# Altium project A7000RiscPC_Joystick.PrjPcb
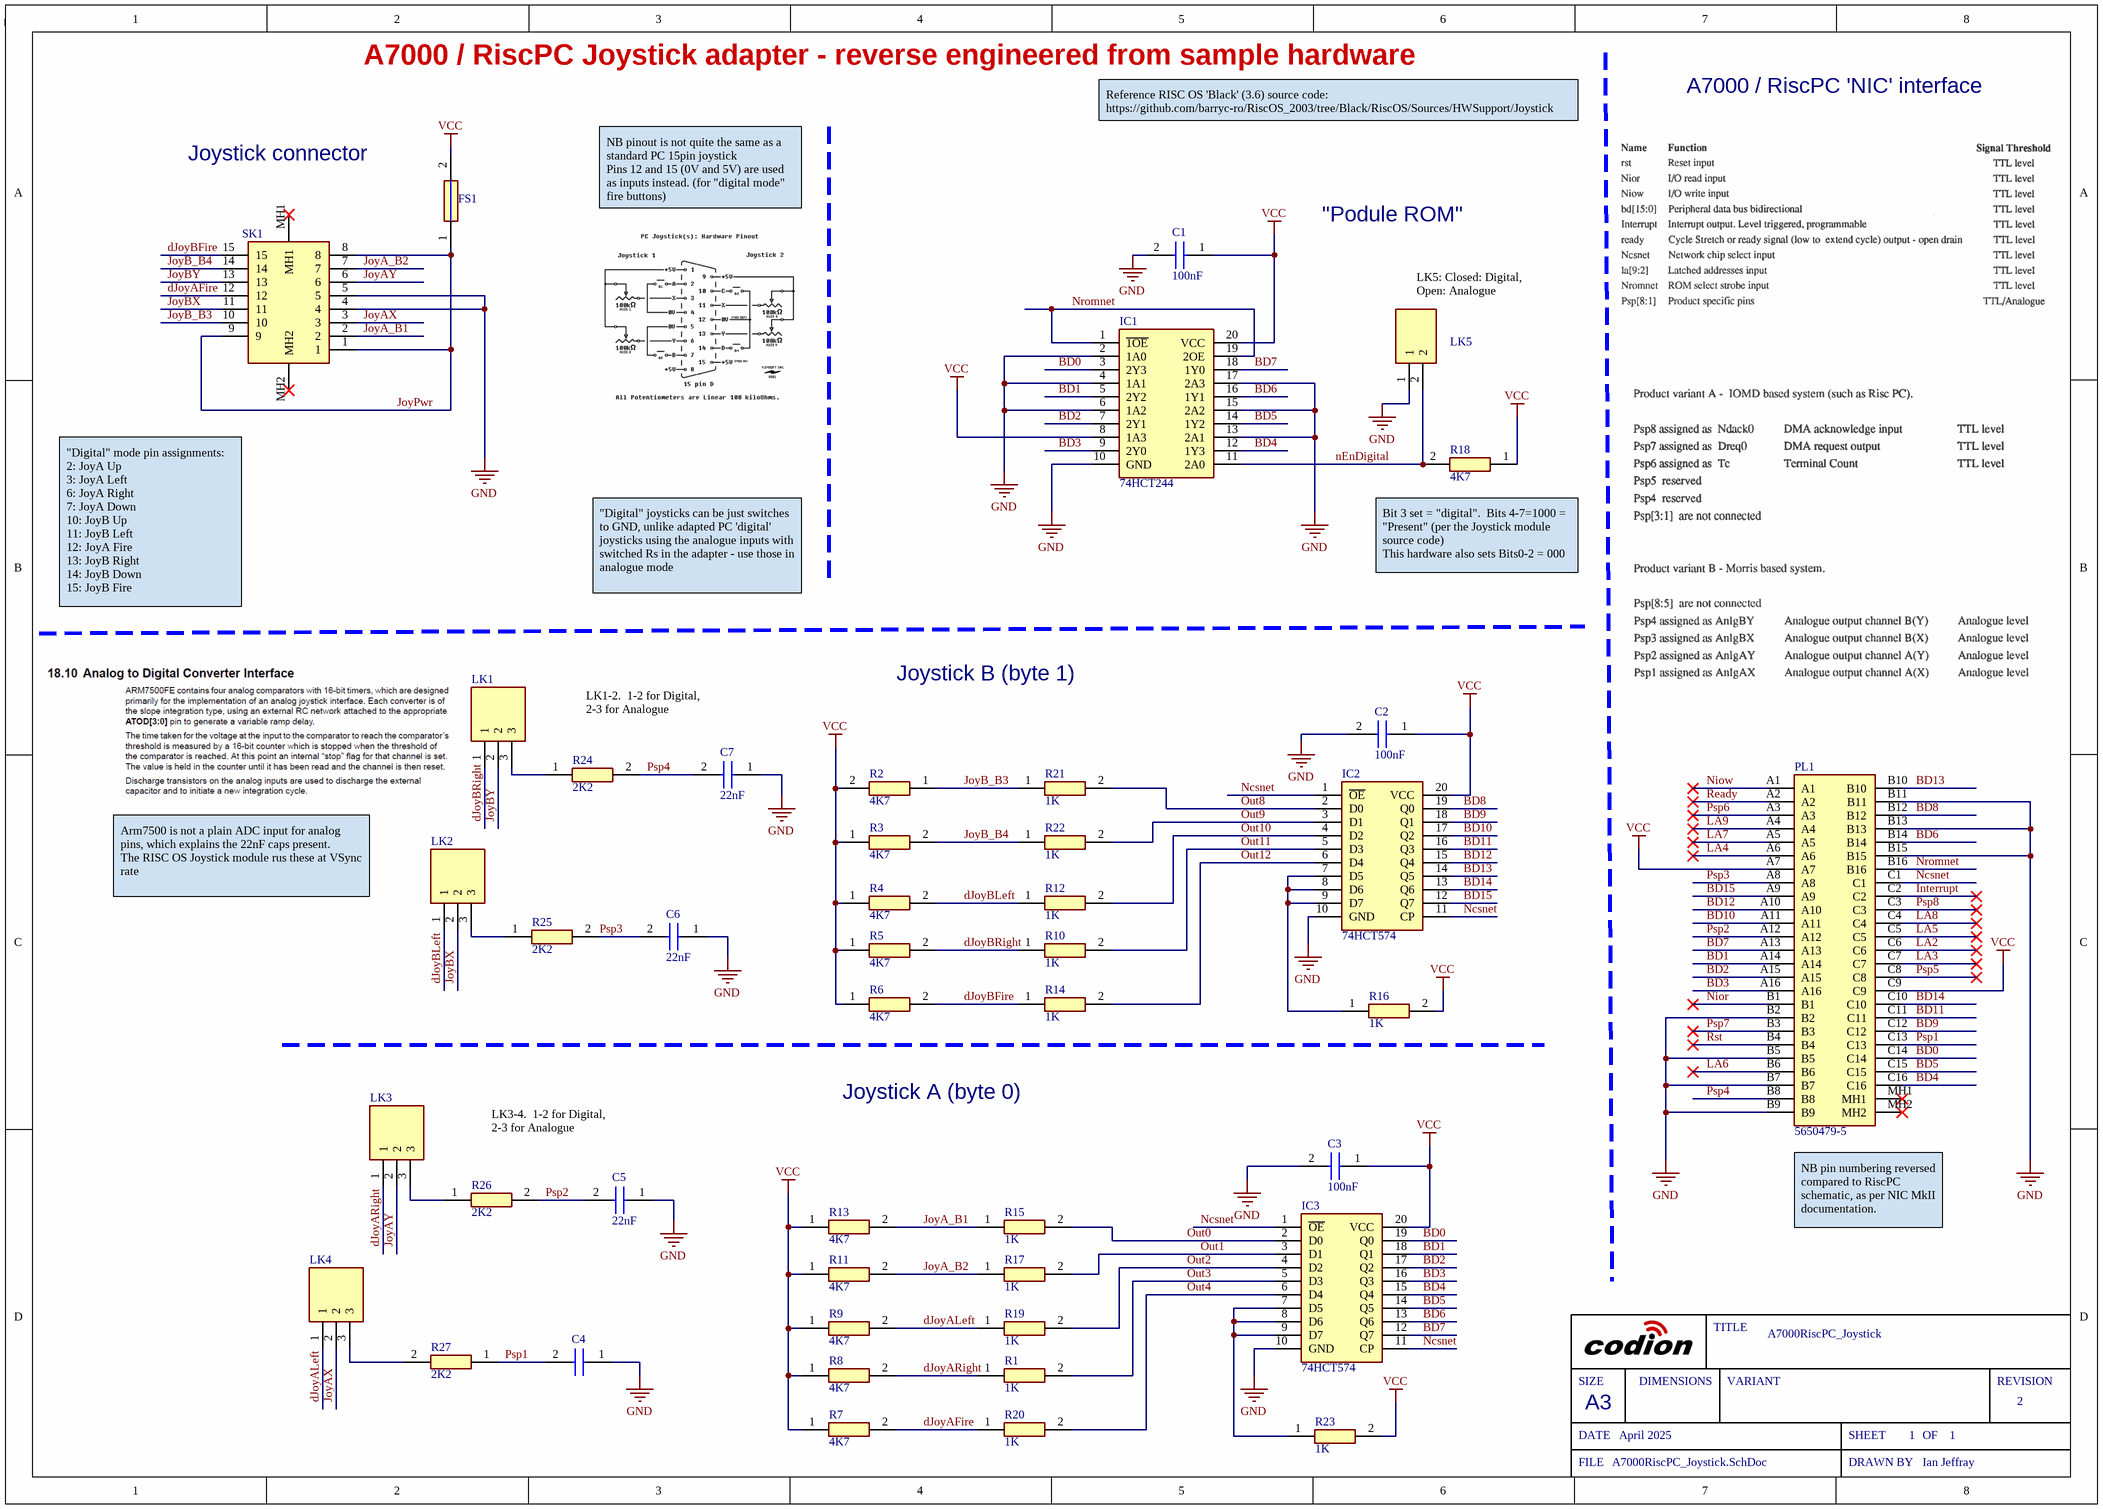
[diagram p0: A7000RiscPC_Joystick.SchDoc]
Sch_RevNo: 2; Sch_ReleaseDate: April 2025; Project_Title: A7000RiscPC_Joystick; DrawnBy: Ian Jeffray
1 sheet, 45 parts. Net scope: global (net labels, ports and power ports of the same name join across sheets).
Board file: A7000RiscPC_Joystick.PcbDoc

## Sheet A7000RiscPC_Joystick.SchDoc
size A3; SheetNumber: 1; SheetTotal: 1

### Parts
C1  100nF  [CAPC1608X90N]
C2  100nF  [CAPC1608X90N]
C3  100nF  [CAPC1608X90N]
C4  06033C104KAT4A  [CAPC1608X90N]  (value not drawn)
C5  22nF  [CAPC1608X90N]
C6  22nF  [CAPC1608X90N]
C7  22nF  [CAPC1608X90N]
FS1  0679L0250-05  [FUSC6125X279N]  (value not drawn)
IC1  74HCT244  [SOIC127P1030X265-20N]
IC2  74HCT574  [SOIC127P1030X265-20N]
IC3  74HCT574  [SOIC127P1030X265-20N]
LK1  PREC003SAAN-RC  [HDRV3W64P0X254_1X3_762X254X868P]  (value not drawn)
LK2  PREC003SAAN-RC  [HDRV3W64P0X254_1X3_762X254X868P]  (value not drawn)
LK3  PREC003SAAN-RC  [HDRV3W64P0X254_1X3_762X254X868P]  (value not drawn)
LK4  PREC003SAAN-RC  [HDRV3W64P0X254_1X3_762X254X868P]  (value not drawn)
LK5  PREC002SAAN-RC  [HDRV2W64P0X254_1X2_508X254X854P]  (value not drawn)
PL1  5650479-5  [56504795]
R1  1K  [RESC1005X35N]
R2  4K7  [RESC1005X35N]
R3  4K7  [RESC1005X35N]
R4  4K7  [RESC1005X35N]
R5  4K7  [RESC1005X35N]
R6  4K7  [RESC1005X35N]
R7  4K7  [RESC1005X35N]
R8  4K7  [RESC1005X35N]
R9  4K7  [RESC1005X35N]
R10  1K  [RESC1005X35N]
R11  4K7  [RESC1005X35N]
R12  1K  [RESC1005X35N]
R13  4K7  [RESC1005X35N]
R14  1K  [RESC1005X35N]
R15  1K  [RESC1005X35N]
R16  1K  [RESC1005X35N]
R17  1K  [RESC1005X35N]
R18  4K7  [RESC1005X35N]
R19  1K  [RESC1005X35N]
R20  1K  [RESC1005X35N]
R21  1K  [RESC1005X35N]
R22  1K  [RESC1005X35N]
R23  1K  [RESC1005X35N]
R24  2K2  [RESC1005X35N]
R25  2K2  [RESC1005X35N]
R26  2K2  [RESC1005X35N]
R27  2K2  [RESC1005X35N]
SK1  5747845-4  [57478454]  (value not drawn)

### Nets
GND: C1.2 C2.2 C3.2 C4.1 C5.1 C6.1 C7.1 IC1.2(1A0) IC1.4(1A1) IC1.6(1A2) IC1.10(GND) IC1.13(2A1) IC1.15(2A2) IC1.17(2A3) IC2.10(GND) IC3.10(GND) LK5.1 PL1.B2 PL1.B5 PL1.B7 PL1.B9 PL1.B11 PL1.B13 PL1.B15 SK1.4 SK1.5
VCC: C1.1 C2.1 C3.1 FS1.2 IC1.8(1A3) IC1.20(VCC) IC2.20(VCC) IC3.20(VCC) PL1.A7 PL1.C9 R2.2 R3.1 R4.1 R5.1 R6.1 R7.1 R8.1 R9.1 R11.1 R13.1 R16.2 R18.1 R23.2
BD0: IC1.3(2Y3) IC3.19(Q0) PL1.C14
BD1: IC1.5(2Y2) IC3.18(Q1) PL1.A14
BD2: IC1.7(2Y1) IC3.17(Q2) PL1.A15
BD3: IC1.9(2Y0) IC3.16(Q3) PL1.A16
BD4: IC1.12(1Y3) IC3.15(Q4) PL1.C16
BD5: IC1.14(1Y2) IC3.14(Q5) PL1.C15
BD6: IC1.16(1Y1) IC3.13(Q6) PL1.B14
BD7: IC1.18(1Y0) IC3.12(Q7) PL1.A13
BD8: IC2.19(Q0) PL1.B12
BD9: IC2.18(Q1) PL1.C12
BD10: IC2.17(Q2) PL1.A11
BD11: IC2.16(Q3) PL1.C11
BD12: IC2.15(Q4) PL1.A10
BD13: IC2.14(Q5) PL1.B10
BD14: IC2.13(Q6) PL1.C10
BD15: IC2.12(Q7) PL1.A9
dJoyAFire: R7.2 R20.1 SK1.12
dJoyALeft: LK4.1 R9.2 R19.1
dJoyARight: LK3.1 R1.1 R8.2
dJoyBFire: R6.2 R14.1 SK1.15
dJoyBLeft: LK2.1 R4.2 R12.1
dJoyBRight: LK1.1 R5.2 R10.1
Interrupt: PL1.C2
JoyA_B1: R13.2 R15.1 SK1.2
JoyA_B2: R11.2 R17.1 SK1.7
JoyAX: LK4.2 SK1.3
JoyAY: LK3.2 SK1.6
JoyB_B3: R2.1 R21.1 SK1.10
JoyB_B4: R3.2 R22.1 SK1.14
JoyBX: LK2.2 SK1.11
JoyBY: LK1.2 SK1.13
JoyPwr: FS1.1 SK1.1 SK1.8 SK1.9
LA2: PL1.C6
LA3: PL1.C7
LA4: PL1.A6
LA5: PL1.C5
LA6: PL1.B6
LA7: PL1.A5
LA8: PL1.C4
LA9: PL1.A4
Ncsnet: IC2.1(~{OE}) IC2.11(CP) IC3.1(~{OE}) IC3.11(CP) PL1.C1
nEnDigital: IC1.11(2A0) LK5.2 R18.2
Nior: PL1.B1
Niow: PL1.A1
Nromnet: IC1.1(~{1OE}) IC1.19(2OE) PL1.B16
Out0: IC3.2(D0) R15.2
Out1: IC3.3(D1) R17.2
Out2: IC3.4(D2) R19.2
Out3: IC3.5(D3) R1.2
Out4: IC3.6(D4) R20.2
Out8: IC2.2(D0) R21.2
Out9: IC2.3(D1) R22.2
Out10: IC2.4(D2) R12.2
Out11: IC2.5(D3) R10.2
Out12: IC2.6(D4) R14.2
Psp1: C4.2 PL1.C13 R27.1
Psp2: C5.2 PL1.A12 R26.2
Psp3: C6.2 PL1.A8 R25.2
Psp4: C7.2 PL1.B8 R24.2
Psp5: PL1.C8
Psp6: PL1.A3
Psp7: PL1.B3
Psp8: PL1.C3
Ready: PL1.A2
Rst: PL1.B4
NetIC2_7: IC2.7(D5) IC2.8(D6) IC2.9(D7) R16.1
NetIC3_7: IC3.7(D5) IC3.8(D6) IC3.9(D7) R23.1
NetLK1_3: LK1.3 R24.1
NetLK2_3: LK2.3 R25.1
NetLK3_3: LK3.3 R26.1
NetLK4_3: LK4.3 R27.2

Not connected (* = marked no-connect by the designer): PL1 MH1* MH2*; SK1 MH1* MH2*

### Notes on the sheet
- A7000 / RiscPC Joystick adapter - reverse engineered from sample hardware
- A7000 / RiscPC 'NIC' interface
- Joystick connector
- Reference RISC OS 'Black' (3.6) source code:
  https://github.com/barryc-ro/RiscOS_2003/tree/Black/RiscOS/Sources/HWSupport/Joystick
- NB pinout is not quite the same as a standard PC 15pin joystick
  Pins 12 and 15 (0V and 5V) are used as inputs instead. (for "digital mode" fire buttons)
- "Podule ROM"
- LK5: Closed: Digital, Open: Analogue
- "Digital" joysticks can be just switches to GND, unlike adapted PC 'digital' joysticks using the analogue inputs with switched Rs in the adapter - use those in analogue mode
- (near R18) Bit 3 set = "digital".  Bits 4-7=1000 = "Present" (per the Joystick module source code)
  This hardware also sets Bits0-2 = 000
- "Digital" mode pin assignments:
  2: JoyA Up
  3: JoyA Left
  6: JoyA Right
  7: JoyA Down
  10: JoyB Up
  11: JoyB Left
  12: JoyA Fire
  13: JoyB Right
  14: JoyB Down
  15: JoyB Fire
- LK1-2.  1-2 for Digital, 2-3 for Analogue
- Joystick B (byte 1)
- Arm7500 is not a plain ADC input for analog pins, which explains the 22nF caps present.
  The RISC OS Joystick module rus these at VSync rate
- Joystick A (byte 0)
- LK3-4.  1-2 for Digital, 2-3 for Analogue
- (near PL1) NB pin numbering reversed compared to RiscPC schematic, as per NIC MkII documentation.
- SIZE
- DIMENSIONS
- TITLE
- VARIANT
- REVISION
- DATE
- A3
- SHEET
- OF
- FILE
- DRAWN BY

### Library data of the parts
C1-C4 = 06033C104KAT4A: Capacitor; Manufacturer_Name: AVX; Datasheet Link: http://www.mouser.com/catalog/supplier/library/pdf/AVXSurfaceMountCeramic.pdf; Height: 0.9mm; Manufacturer_Part_Number: 06033C104KAT4A; Mouser Part Number: 581-06033C104KAT4A; Mouser Price/Stock: https://www.mouser.co.uk/ProductDetail/AVX/06033C104KAT4A?qs=8C2chATdSPiv3E9zfPZulg%3D%3D; Arrow Part Number: 06033C104KAT4A; Arrow Price/Stock: https://www.arrow.com/en/products/06033c104kat4a/avx?region=nac
C5-C7 = 06035C223JAT2A: Capacitor; Manufacturer_Name: Kyocera AVX; Datasheet Link: https://componentsearchengine.com/Datasheets/1/06031A100FAT2A.pdf; Height: 0.9mm; Manufacturer_Part_Number: 06035C223JAT2A; Mouser Part Number: 581-06035C223JAT2A; Mouser Price/Stock: https://www.mouser.co.uk/ProductDetail/AVX/06035C223JAT2A?qs=afD3lGjG3YqhAkr5SYOZ9w%3D%3D; Arrow Part Number: 06035C223JAT2A; Arrow Price/Stock: https://www.arrow.com/en/products/06035c223jat2a/avx?region=nac
FS1 = 0679L0250-05: Fuse; Manufacturer_Name: BelFuse; Datasheet Link: https://componentsearchengine.com/Datasheets/1/0679L0250-05.pdf; Height: 2.79mm; Manufacturer_Part_Number: 0679L0250-05; Mouser Part Number: 530-0679L0250-05; Mouser Price/Stock: https://www.mouser.co.uk/ProductDetail/Bel-Fuse/0679L0250-05?qs=ZqXcJfGlKshcahFINUdbuA%3D%3D; Arrow Part Number: 0679L0250-05; Arrow Price/Stock: https://www.arrow.com/en/products/0679l0250-05/bel-group
IC1 = CD74HCT244M: Integrated Circuit; Manufacturer_Name: Texas Instruments; Datasheet Link: http://www.ti.com/lit/ds/symlink/cd74hct244.pdf; Height: 2.65mm; Manufacturer_Part_Number: CD74HCT244M; Mouser Part Number: 595-CD74HCT244M; Mouser Price/Stock: https://www.mouser.co.uk/ProductDetail/Texas-Instruments/CD74HCT244M?qs=Zu35EjizYSTgCG79gnRrHA%3D%3D; Arrow Part Number: CD74HCT244M; Arrow Price/Stock: https://www.arrow.com/en/products/cd74hct244m/texas-instruments
IC2 IC3 = CD74HCT574M: Integrated Circuit; Manufacturer_Name: Texas Instruments; Datasheet Link: http://www.ti.com/lit/ds/symlink/cd74hct574.pdf; Height: 2.65mm; Manufacturer_Part_Number: CD74HCT574M; Mouser Part Number: 595-CD74HCT574M; Mouser Price/Stock: https://www.mouser.co.uk/ProductDetail/Texas-Instruments/CD74HCT574M?qs=vul0MlC%2Fa1fKWyIOireUAw%3D%3D
LK1-LK4 = PREC003SAAN-RC: Connector; Manufacturer_Name: Sullins; Datasheet Link: https://media.digikey.com/PDF/Data%20Sheets/Sullins%20PDFs/z%20RzCzzzSzzN-RC,%20ST,11635-B.pdf; Height: 8.68mm; Manufacturer_Part_Number: PREC003SAAN-RC
LK5 = PREC002SAAN-RC: Connector; Manufacturer_Name: Sullins; Datasheet Link: https://drawings-pdf.s3.amazonaws.com/11635.pdf; Height: 8.54mm; Manufacturer_Part_Number: PREC002SAAN-RC
PL1 = 5650479-5: Connector; Manufacturer_Name: TE Connectivity; Datasheet Link: https://www.te.com/commerce/DocumentDelivery/DDEController?Action=showdoc&DocId=Customer+Drawing%7F5650479%7FP%7Fpdf%7FEnglish%7FENG_CD_5650479_P.pdf%7F5650479-5; Height: 11.61mm; Manufacturer_Part_Number: 5650479-5; Mouser Part Number: 571-5650479-5; Mouser Price/Stock: https://www.mouser.co.uk/ProductDetail/TE-Connectivity/5650479-5?qs=xrnNvQC1SKQu%252BZBLSdOcFw%3D%3D; Arrow Part Number: 5650479-5; Arrow Price/Stock: https://www.arrow.com/en/products/5650479-5/te-connectivity?region=europe
R1 R10 R12 R14 R15 R17 R19-R23 = CPF0402B102KE1: Resistor; Manufacturer_Name: TE Connectivity; Datasheet Link: http://www.farnell.com/datasheets/1786775.pdf; Height: 0.35mm; Manufacturer_Part_Number: CPF0402B102KE1; Mouser Part Number: 279-CPF0402B102KE1; Mouser Price/Stock: https://www.mouser.com/Search/Refine.aspx?Keyword=279-CPF0402B102KE1
R2-R9 R11 R13 R18 = CPF0402B4K7E: Resistor; Manufacturer_Name: TE Connectivity; Datasheet Link: http://www.farnell.com/datasheets/1786775.pdf; Height: 0.35mm; Manufacturer_Part_Number: CPF0402B4K7E; Mouser Part Number: 279-CPF0402B4K7E; Mouser Price/Stock: https://www.mouser.co.uk/ProductDetail/TE-Connectivity-Holsworthy/CPF0402B4K7E?qs=gt1LBUVyoHnSdGQa1TSPWQ%3D%3D; Arrow Part Number: CPF0402B4K7E; Arrow Price/Stock: https://www.arrow.com/en/products/cpf0402b4k7e/te-connectivity?region=nac
R16 R24-R27 = CPF0402B2K2E: Resistor; Manufacturer_Name: TE Connectivity; Datasheet Link: http://www.farnell.com/datasheets/1786775.pdf; Height: 0.35mm; Manufacturer_Part_Number: CPF0402B2K2E; Mouser Part Number: N/A; Mouser Price/Stock: https://www.mouser.com/Search/Refine.aspx?Keyword=N%2FA
SK1 = 5747845-4: Connector; Manufacturer_Name: TE Connectivity; Datasheet Link: http://www.te.com/commerce/DocumentDelivery/DDEController?Action=showdoc&DocId=Customer+Drawing%7F5747845%7FA2%7Fpdf%7FEnglish%7FENG_CD_5747845_A2.pdf%7F5747845-4; Height: 12.5476mm; Manufacturer_Part_Number: 5747845-4; Mouser Part Number: 571-5747845-4; Mouser Price/Stock: https://www.mouser.co.uk/ProductDetail/TE-Connectivity/5747845-4?qs=x6EjVpvqMVM20FyCQQpjQA%3D%3D; Arrow Part Number: 5747845-4; Arrow Price/Stock: https://www.arrow.com/en/products/5747845-4/te-connectivity?region=europe